# EasyEDA Pro project ProPrj_AUCompetition.epro, schematic 主控

## Sheets
1 电源: Assembly Variant: Basic; Board Name: Board1; Create Date: 2026-04-04; Page Name: P1; Project Name: 21届智控大赛; Schematic Name: Schematic1; Update Date: 2026-04-04; BladeWidth: 10; Company: 嘉立创EDA; Drawed: 郑一航; Page Size: A4; RegionStart: 1; Reviewed: 郑一航; ShowBorder: 1; TitleBlock: 1; TitleBlockPosition: 3; Version: V1.0; XRegionCount: 6; YRegionCount: 4
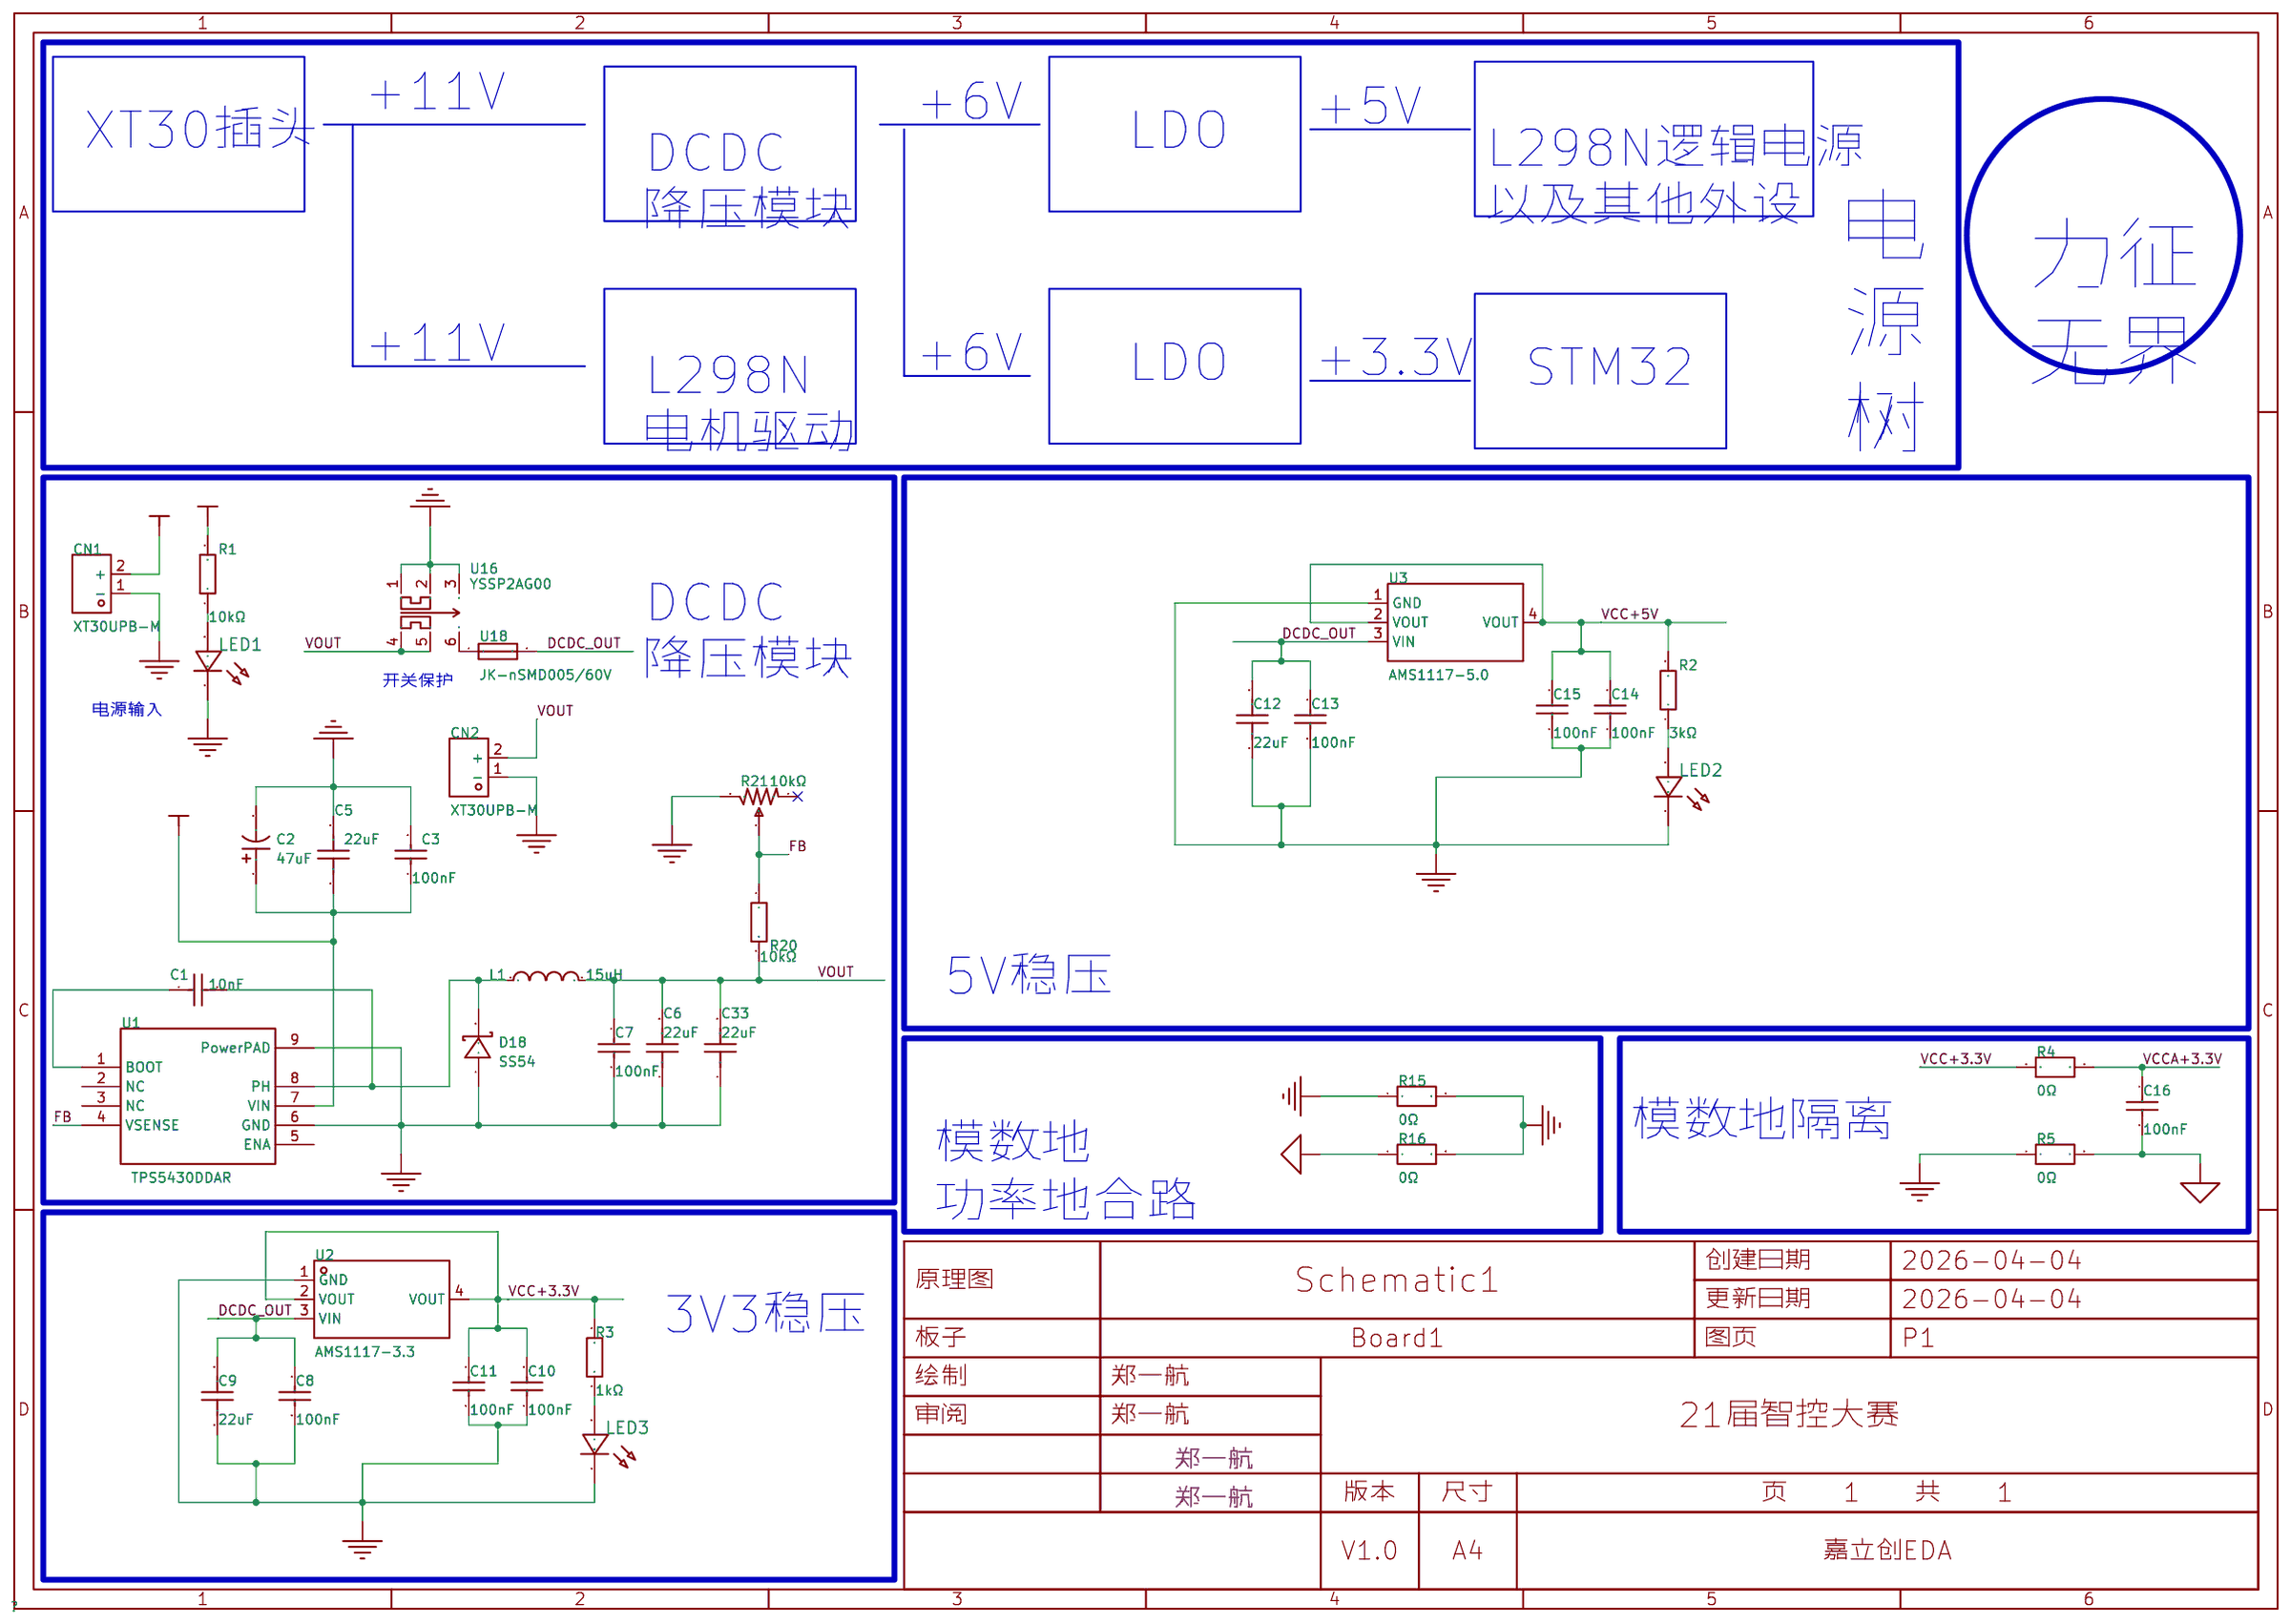
[diagram p2: 电源]
2 单片机: Board Name: 主控; Create Date: 2026-04-05; Schematic Name: 主控; Update Date: 2026-04-05
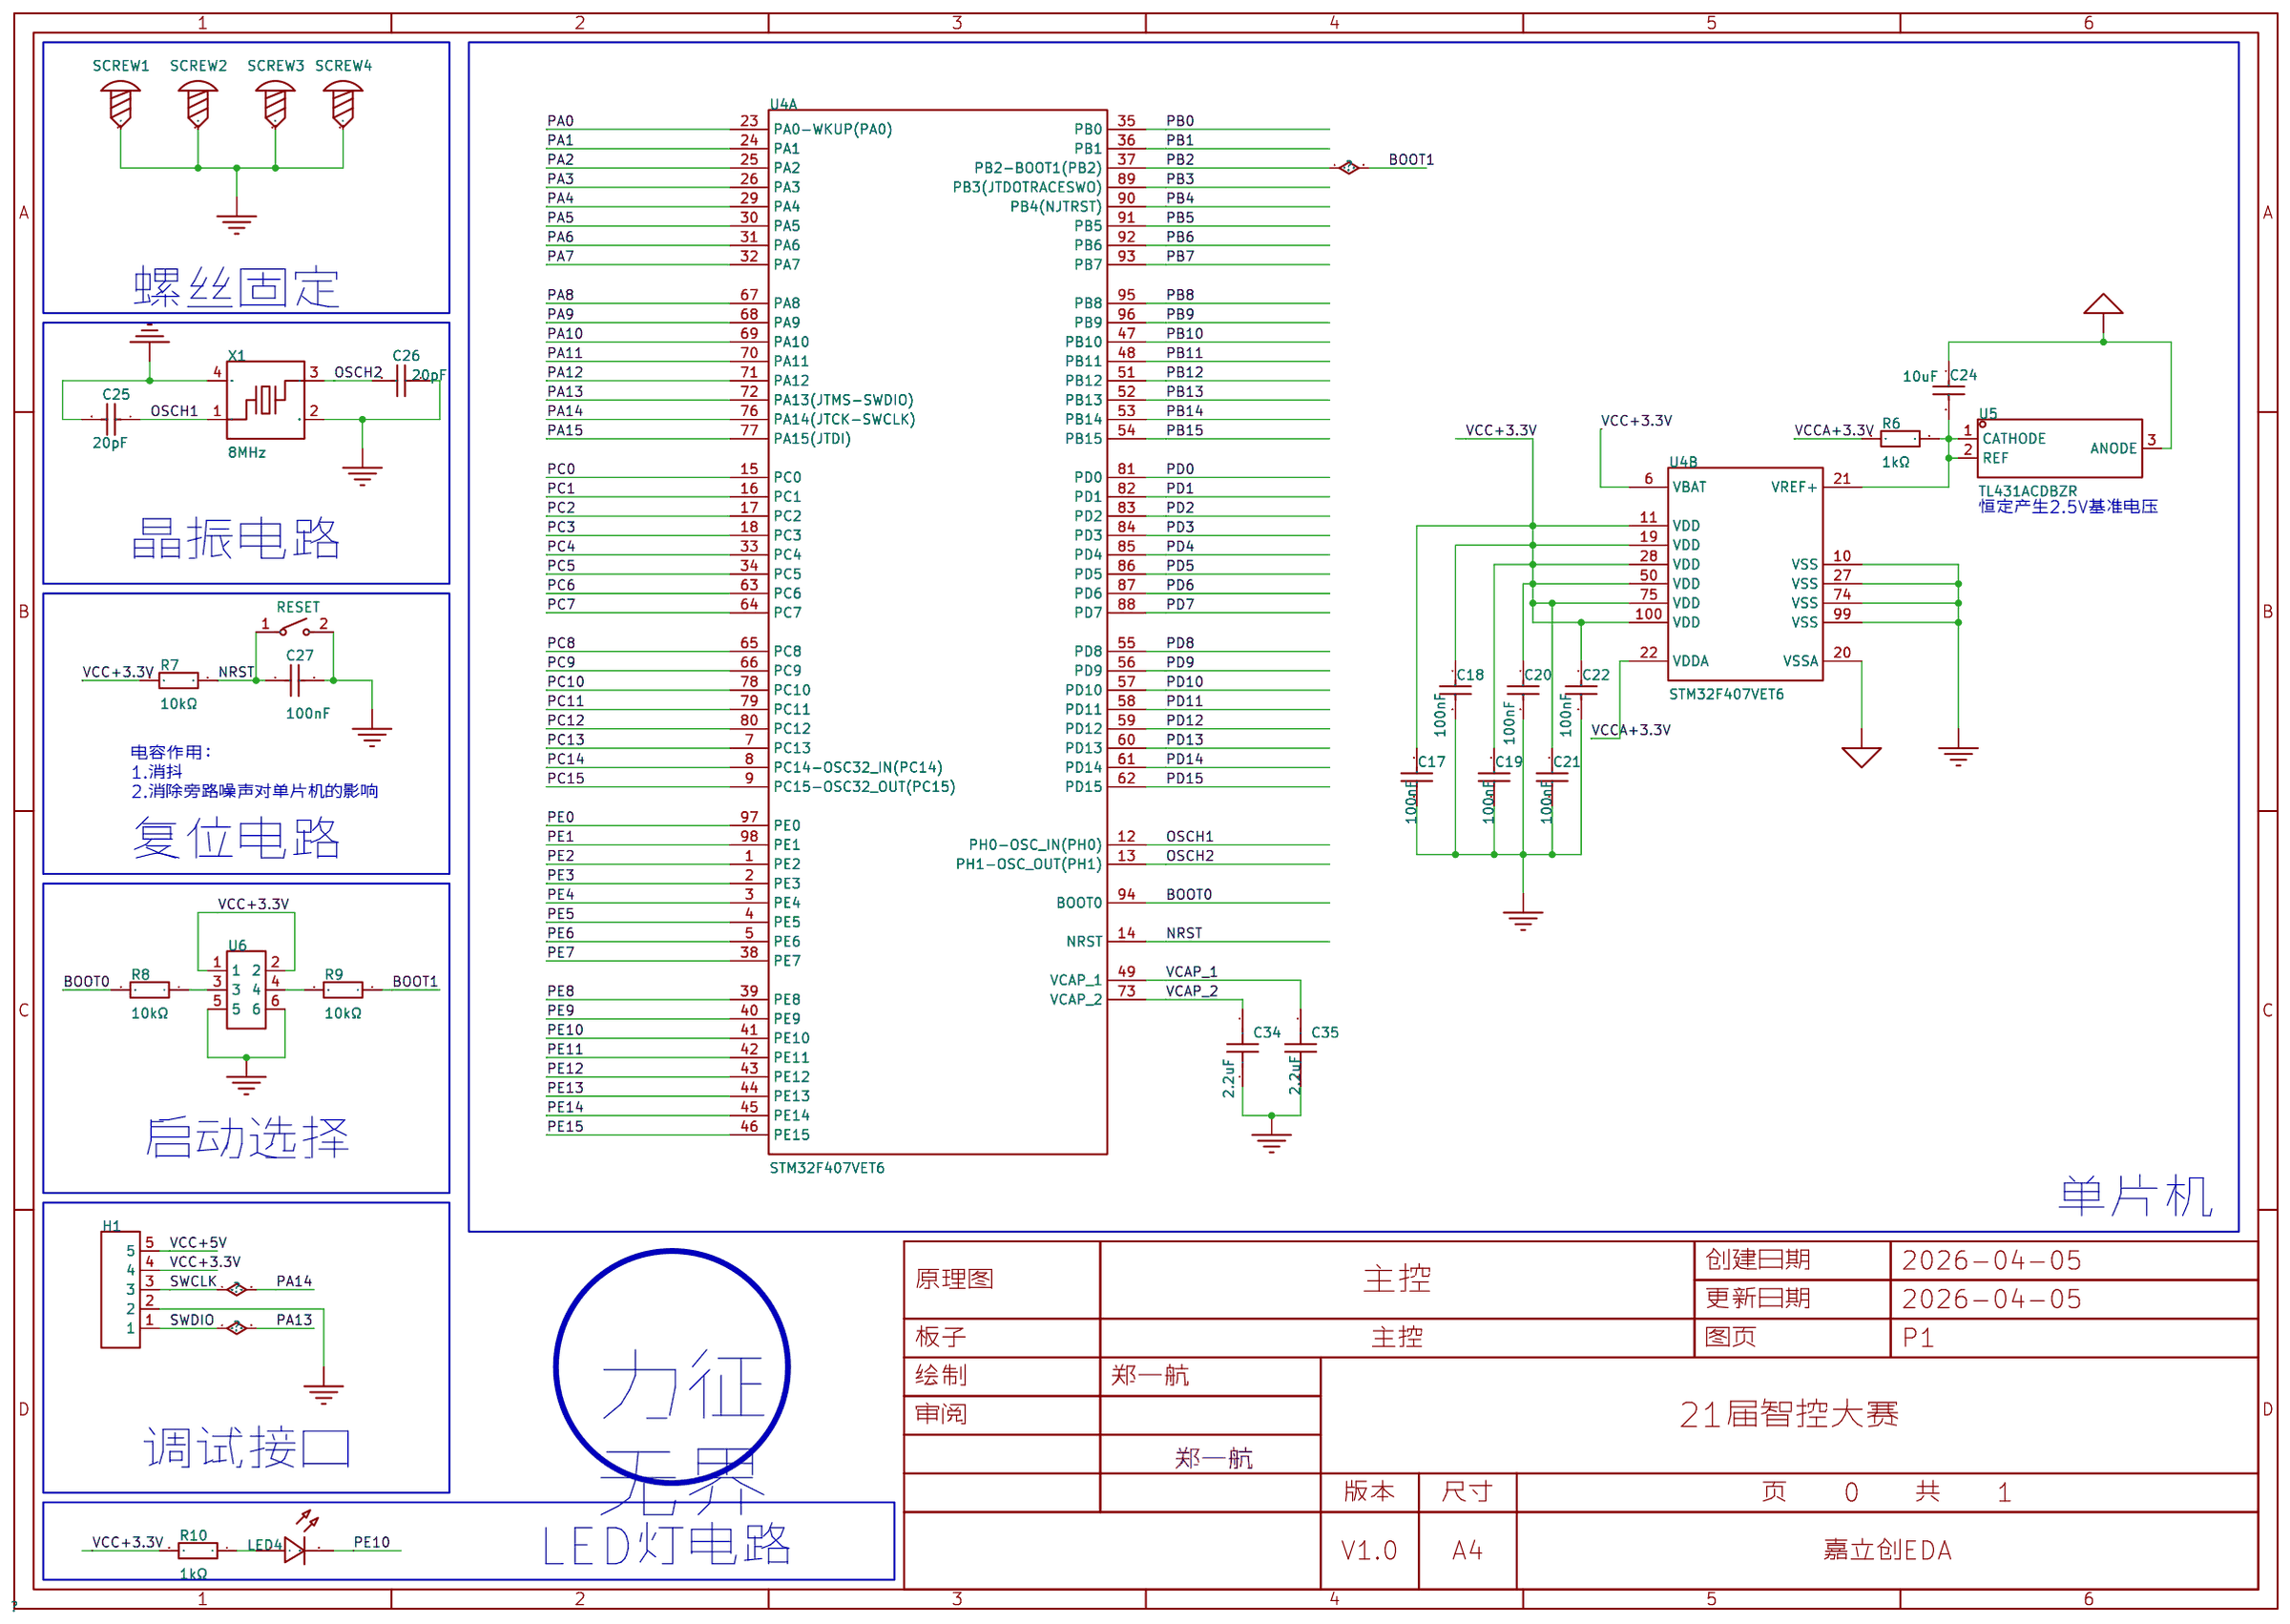
[diagram p3: 单片机]
3 接口: Board Name: 主控; Create Date: 2026-04-05; Schematic Name: 主控; Update Date: 2026-04-05
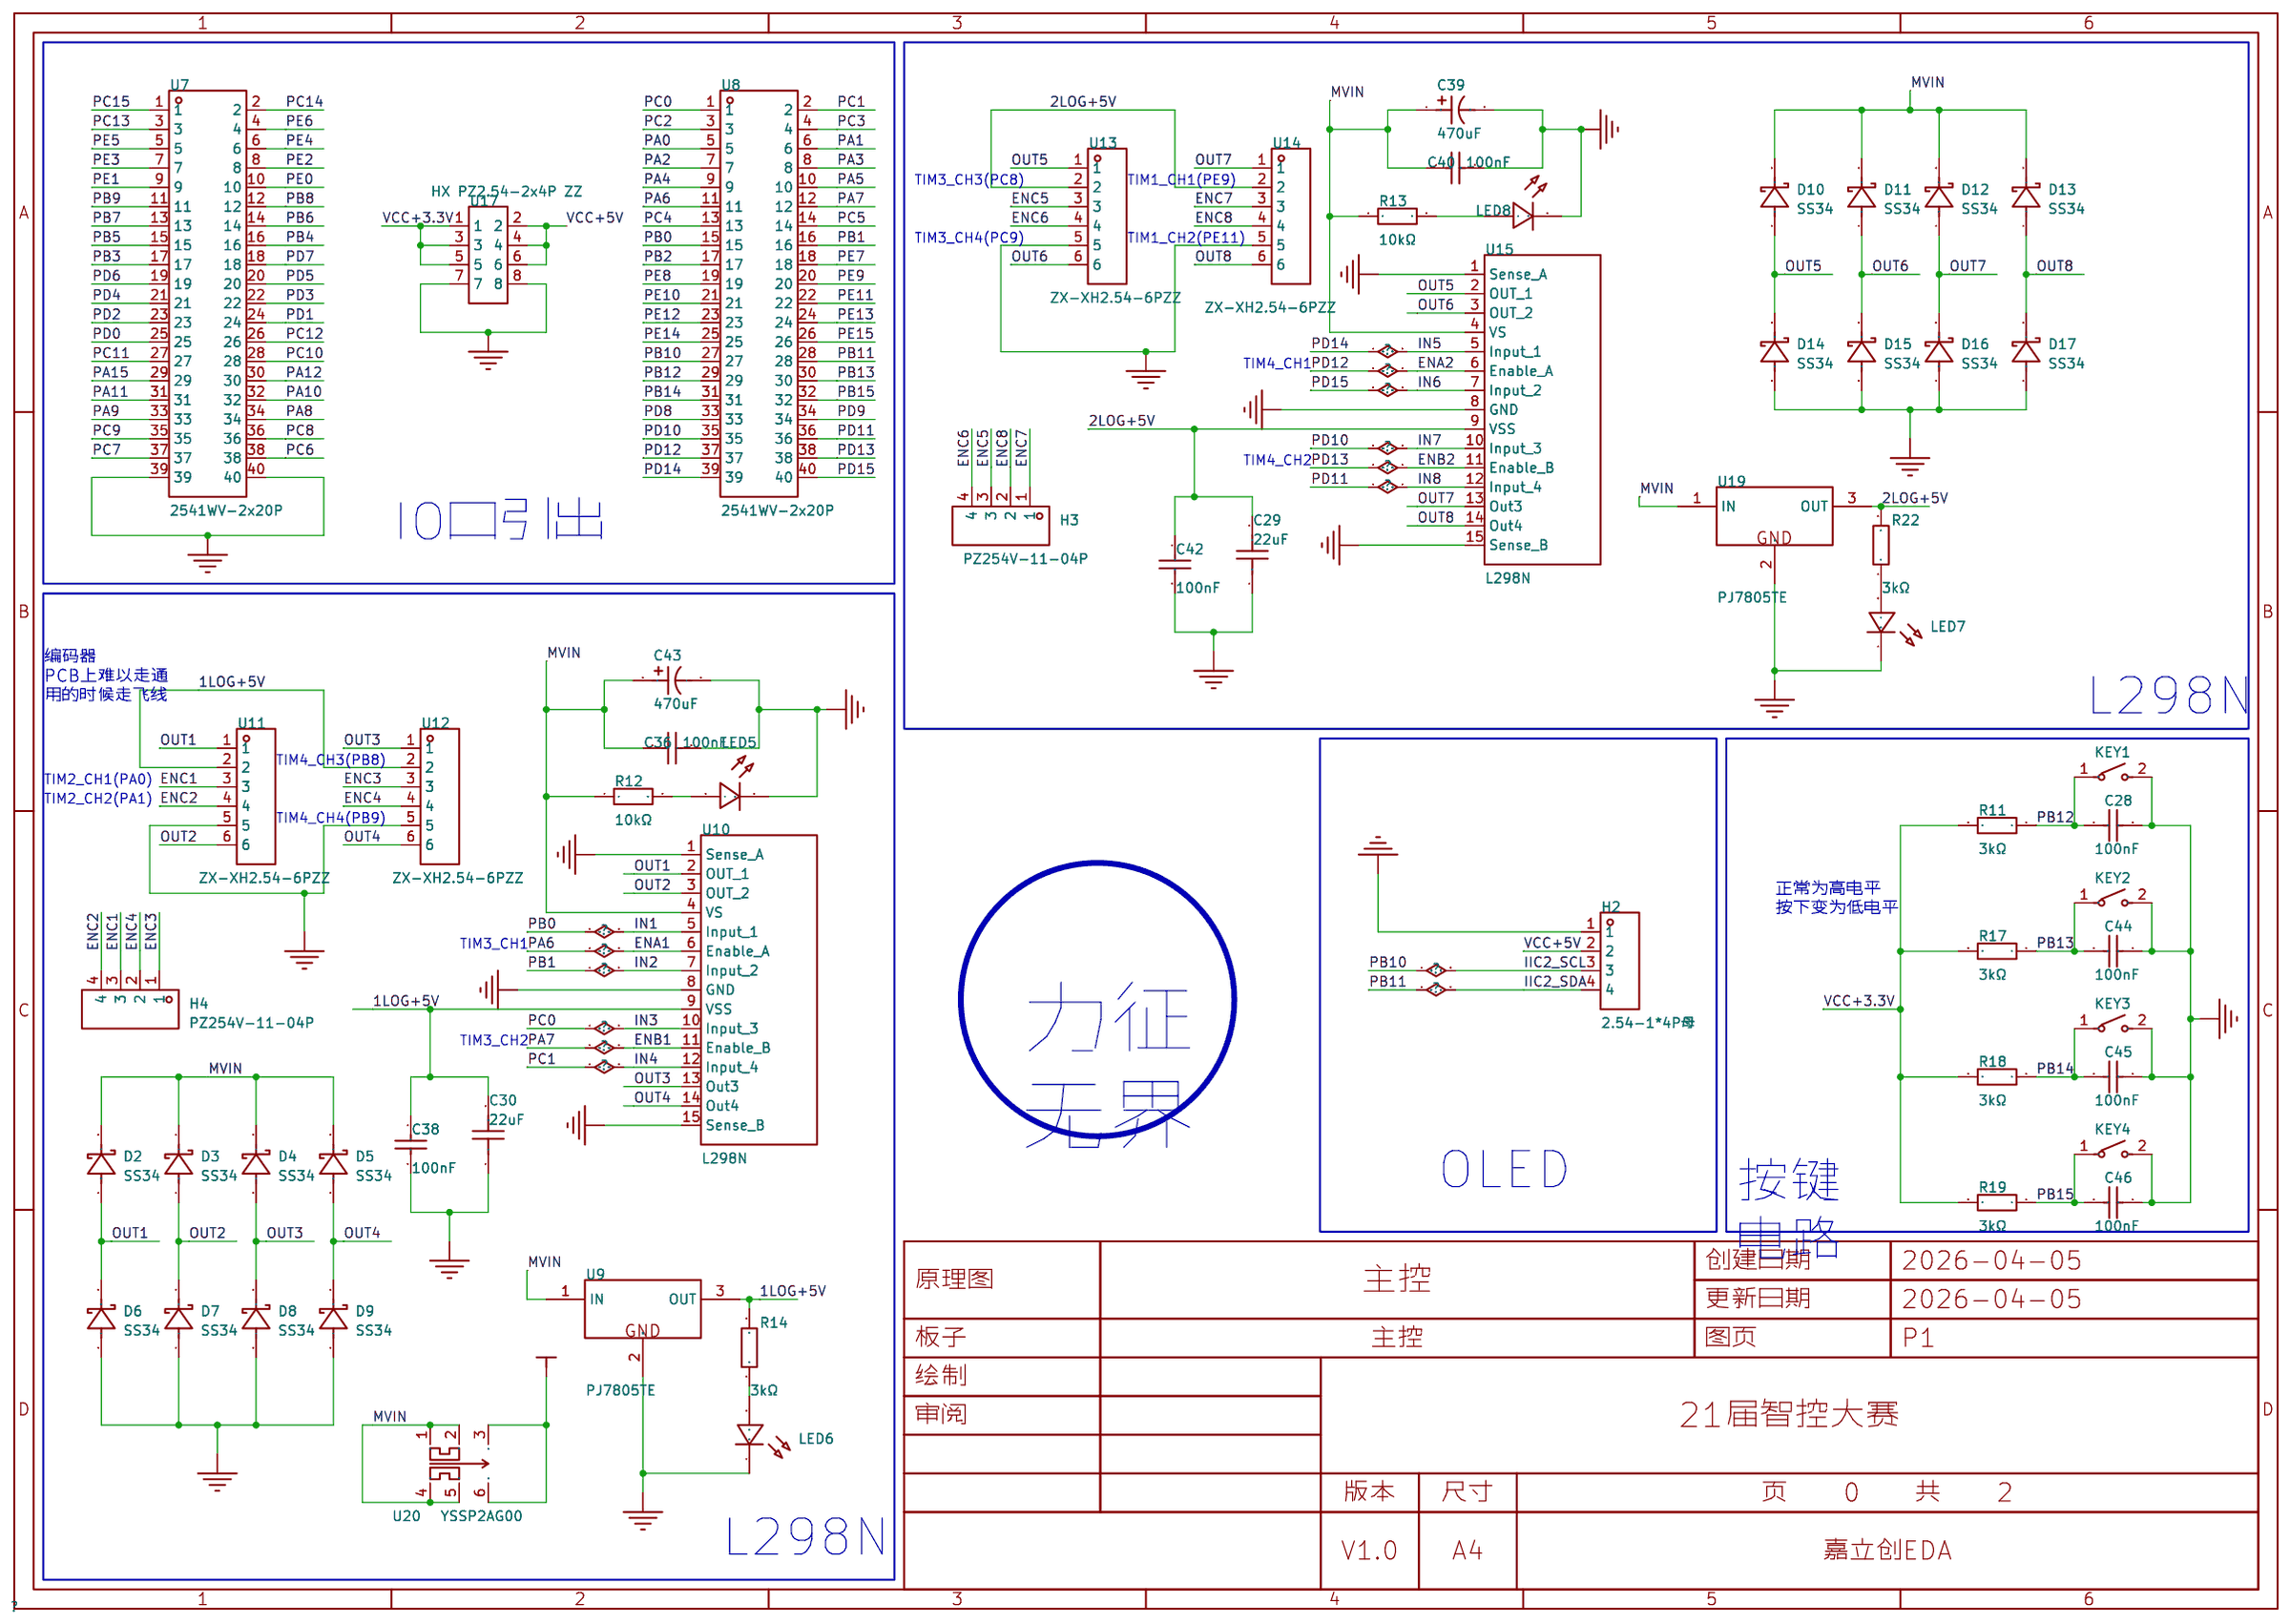
[diagram p4: 接口]

## Parts
sheet 单片机
C17  100nF  [C0805]
C18  100nF  [C0805]
C19  100nF  [C0805]
C20  100nF  [C0805]
C21  100nF  [C0805]
C22  100nF  [C0805]
C24  10uF  [C0805]
C25  20pF  [C0805]
C26  20pF  [C0805]
C27  100nF  [C0805]
C34  2.2uF  [C0805]
C35  2.2uF  [C0805]
H1  PZ254V-11-05P  [HDR-TH_5P-P2.54-V-M]
LED4  -  [LED_0805]
R6  1kΩ  [R0805]
R7  10kΩ  [R0805]
R8  10kΩ  [R0805]
R9  10kΩ  [R0805]
R10  1kΩ  [R0805]
RESET  TS-1088R-02026  [SW-SMD_L3.9-W3.0-P4.45]
SCREW1  -  [M3螺丝]
SCREW2  -  [M3螺丝]
SCREW3  -  [M3螺丝]
SCREW4  -  [M3螺丝]
U4  STM32F407VET6  [LQFP-100_L14.0-W14.0-P0.50-LS16.0-BL]  (sections 1,2)
U5  TL431ACDBZR  [SOT-23-3_L3.0-W1.7-P0.95-LS2.9-BR]
U6  DS1021-2x3SF11-B  [HDR-TH_6P-P2.54-V-M-R2-C3-S2.54]
X1  8MHz  [CRYSTAL-SMD_4P-L3.2-W2.5-BL_SIT8008BI]
sheet 接口
C28  100nF  [C0805]
C29  22uF  [C1210]
C30  22uF  [C1210]
C36  100nF  [C0805]
C38  100nF  [C0805]
C39  470uF  [CAP-TH_BD10.0-P5.00-D0.6-FD-A]
C40  100nF  [C0805]
C42  100nF  [C0805]
C43  470uF  [CAP-TH_BD10.0-P5.00-D0.6-FD-A]
C44  100nF  [C0805]
C45  100nF  [C0805]
C46  100nF  [C0805]
D2  SS34  [SMA_L4.3-W2.6-LS5.0-FD]
D3  SS34  [SMA_L4.3-W2.6-LS5.0-FD]
D4  SS34  [SMA_L4.3-W2.6-LS5.0-FD]
D5  SS34  [SMA_L4.3-W2.6-LS5.0-FD]
D6  SS34  [SMA_L4.3-W2.6-LS5.0-FD]
D7  SS34  [SMA_L4.3-W2.6-LS5.0-FD]
D8  SS34  [SMA_L4.3-W2.6-LS5.0-FD]
D9  SS34  [SMA_L4.3-W2.6-LS5.0-FD]
D10  SS34  [SMA_L4.3-W2.6-LS5.0-FD]
D11  SS34  [SMA_L4.3-W2.6-LS5.0-FD]
D12  SS34  [SMA_L4.3-W2.6-LS5.0-FD]
D13  SS34  [SMA_L4.3-W2.6-LS5.0-FD]
D14  SS34  [SMA_L4.3-W2.6-LS5.0-FD]
D15  SS34  [SMA_L4.3-W2.6-LS5.0-FD]
D16  SS34  [SMA_L4.3-W2.6-LS5.0-FD]
D17  SS34  [SMA_L4.3-W2.6-LS5.0-FD]
H2  2.54-1*4P母  [HDR-TH_4P-P2.54-V-F]
H3  PZ254V-11-04P  [HDR-TH_4P-P2.54-V-M]
H4  PZ254V-11-04P  [HDR-TH_4P-P2.54-V-M]
KEY1  TS-1088R-02026  [SW-SMD_L3.9-W3.0-P4.45]
KEY2  TS-1088R-02026  [SW-SMD_L3.9-W3.0-P4.45]
KEY3  TS-1088R-02026  [SW-SMD_L3.9-W3.0-P4.45]
KEY4  TS-1088R-02026  [SW-SMD_L3.9-W3.0-P4.45]
LED5  -  [LED_0805]
LED6  -  [LED_0805]
LED7  -  [LED_0805]
LED8  -  [LED_0805]
R11  3kΩ  [R0805]
R12  10kΩ  [R0805]
R13  10kΩ  [R0805]
R14  3kΩ  [R0805]
R17  3kΩ  [R0805]
R18  3kΩ  [R0805]
R19  3kΩ  [R0805]
R22  3kΩ  [R0805]
U7  2541WV-2x20P  [HDR-TH_40P-P2.54-V-M-R2-C20-S2.54]
U8  2541WV-2x20P  [HDR-TH_40P-P2.54-V-M-R2-C20-S2.54]
U9  PJ7805TE  [TO-252-2_L6.6-W6.1-P4.57-LS9.9-BR-CW]
U10  L298N  [MULTIWATT-15_L19.6-W5.0-P1.27-L]
U11  ZX-XH2.54-6PZZ  [CONN-TH_6P-P2.50_ZX-XH2.54-6PZZ]
U12  ZX-XH2.54-6PZZ  [CONN-TH_6P-P2.50_ZX-XH2.54-6PZZ]
U13  ZX-XH2.54-6PZZ  [CONN-TH_6P-P2.50_ZX-XH2.54-6PZZ]
U14  ZX-XH2.54-6PZZ  [CONN-TH_6P-P2.50_ZX-XH2.54-6PZZ]
U15  L298N  [MULTIWATT-15_L19.6-W5.0-P1.27-L]
U17  HX PZ2.54-2x4P ZZ  [HDR-TH_8P-P2.54-V-M-R2-C4-S2.54]
U19  PJ7805TE  [TO-252-2_L6.6-W6.1-P4.57-LS9.9-BR-CW]
U20  YSSP2AG00  [SW-SMD_YSSP2AG00]
sheet 电源
C1  10nF  [C0805]
C2  47uF  [CAP-TH_BD8.0-P3.50-D0.6-FD]
C3  100nF  [C0805]
C5  22uF  [C1210]
C6  22uF  [C1210]
C7  100nF  [C0805]
C8  100nF  [C0805]
C9  22uF  [C1210]
C10  100nF  [C0805]
C11  100nF  [C0805]
C12  22uF  [C1210]
C13  100nF  [C0805]
C14  100nF  [C0805]
C15  100nF  [C0805]
C16  100nF  [C0805]
C33  22uF  [C1210]
CN1  XT30UPB-M  [CONN-TH_XT30UPB-M]
CN2  XT30UPB-M  [CONN-TH_XT30UPB-M]
D18  SS54  [SMA_L4.4-W2.8-LS5.4-R-RD]
L1  15uH  [IND-SMD_L7.0-W6.6_FXL0630]
LED1  -  [LED_0805]
LED2  -  [LED_0805]
LED3  -  [LED_0805]
R1  10kΩ  [R0805]
R2  3kΩ  [R0805]
R3  1kΩ  [R0805]
R4  0Ω  [R1206]
R5  0Ω  [R1206]
R15  0Ω  [R1206]
R16  0Ω  [R1206]
R20  10kΩ  [R0805]
R21  10kΩ  [RES-ADJ-TH_3362P]
U1  TPS5430DDAR  [ESOP-8_L4.9-W3.9-P1.27-LS6.0-TL-EP]
U2  AMS1117-3.3  [SOT-223-3_L6.5-W3.4-P2.30-LS7.0-BR]
U3  AMS1117-5.0  [SOT-223_L6.5-W3.5-P2.30-LS7.0-BR]
U16  YSSP2AG00  [SW-SMD_YSSP2AG00]
U18  JK-nSMD005/60V  [F1206]

## Library data of the parts
C3 C7 C8 C10 C11 C13-C22 C24 C27 C28 C36 C38 C40 C42 C44-C46 = CL21B104KBCNNNC: 容值:100nF;精度:±10%;额定电压:50V;温度系数:X7R;; LCSC Part Name: 100nF ±10% 50V; Supplier Part: C1711; Manufacturer: SAMSUNG(三星); Supplier Footprint: 0805; JLCPCB Part Class: 扩展库; Datasheet: https://item.szlcsc.com/datasheet/CL21B104KBCNNNC/2063.html; Supplier: LCSC; Tolerance: ±10%; Voltage Rating: 50V; Temperature Coefficient: X7R
C25 C26 = CL21C200JBANNNC: 容值:20pF;精度:±5%;额定电压:50V;温度系数:C0G;; LCSC Part Name: 20pF ±5% 50V; Supplier Part: C1798; Manufacturer: SAMSUNG(三星); Supplier Footprint: 0805; JLCPCB Part Class: Basic Part; Datasheet: https://item.szlcsc.com/datasheet/CL21C200JBANNNC/2150.html; Supplier: LCSC; Tolerance: ±5%; Voltage Rating: 50V; Temperature Coefficient: C0G
C34 C35 = CL21A225KBQNNNE: 容值:2.2uF;精度:±10%;额定电压:50V;温度系数:X5R;; LCSC Part Name: 2.2uF ±10% 50V; Supplier Part: C377773; Manufacturer: SAMSUNG(三星); Supplier Footprint: 0805; JLCPCB Part Class: Basic Part; Datasheet: https://item.szlcsc.com/datasheet/CL21A225KBQNNNE/350246.html; Supplier: LCSC; Tolerance: ±10%; Voltage Rating: 50V; Temperature Coefficient: X5R
H1 = PZ254V-11-05P: 插针结构:1x5P;间距:2.54mm;行距:-;圆针/方针:方针;安装方式:直插;排数:单排;总PIN位数:5P;额定电流:-;额定电压:-;配合针长度:6mm;塑高:2.5mm;端接针长度:3mm;触头材质:黄铜;触头镀层:-;工作温度:-40℃~+105℃;颜色:黑色;; LCSC Part Name: 1x5P 间距:2.54mm 方针 直插; Supplier Part: C492404; Manufacturer: XFCN(兴飞); Supplier Footprint: 插件,P=2.54mm; JLCPCB Part Class: Extended Part; Datasheet: https://item.szlcsc.com/datasheet/PZ254V-11-05P/502960.html; Supplier: LCSC; Pin Structure: 1x5P; Pitch: 2.54mm; Circluar Pins/Square Pins: 方针; Mounting Type: 直插; Number of Rows: 单排; Number of Pins: 5P; Length of Mating Pin: 6mm; Insulation Height: 2.5mm; Length of End Connection Pin: 3mm; Contact Material: 黄铜; Operating Temperature: -40℃~+105℃; Color: 黑色
LED4 = LED_0805-G: Supplier Footprint: 0805
R1-R3 R6-R14 R17-R20 R22 = 0805W8F1002T5E_C17414: 电阻类型:厚膜电阻;阻值:10kΩ;精度:±1%;功率:125mW;工作电压:150V;温度系数:±100ppm/℃;; LCSC Part Name: 10kΩ ±1% 125mW 厚膜电阻; Supplier Part: C17414; Manufacturer: UNI-ROYAL(厚声); Manufacturer Part: 0805W8F1002T5E; Supplier Footprint: 0805; JLCPCB Part Class: 基础库; Datasheet: https://item.szlcsc.com/datasheet/0805W8F1002T5E/18102.html; Supplier: LCSC; Type: 厚膜电阻; Tolerance: ±1%; Power(Watts): 125mW; Voltage-Supply(Max): 150V; Temperature Coefficient: ±100ppm/℃; Operating Temperature: -55℃~+155℃
KEY1-KEY4 RESET = TS-1088R-02026: 电路结构:单刀单掷;按钮形状:圆形按钮;作用力:2.6N;安装方式:立贴;开关长度:3.9mm;开关宽度:2.93mm;开关高度:2mm;带支架:不带支架;触点电流:50mA;额定电压:12V;带灯:-;工作寿命:10万次;; LCSC Part Name: 3.9*2.93*2mm 立贴 轻触开关; Supplier Part: C455280; Manufacturer: XUNPU(讯普); Supplier Footprint: SMD,4x3mm; JLCPCB Part Class: Extended Part; Datasheet: https://item.szlcsc.com/datasheet/TS-1088R-02026/457635.html; Supplier: LCSC; Circuit: 单刀单掷; Actuator Style: 圆形按钮; Operating Force: 2.6N; Mounting Type: 立贴; Length: 3.9mm; Width: 2.93mm; Switch Height: 2mm; with Bracket: 不带支架; Contact Current: 50mA; Voltage Rating: 12V; Actuator/Cap Color: 黑色; Termination Style: SMD接片; Life: 10万次
SCREW1-SCREW4 = M3螺丝: Supplier Footprint: 插件
U4 = STM32F407VET6: CPU内核:ARM-M4;CPU最大主频:168MHz;应用领域:-;; LCSC Part Name: 带DSP和FPU的高性能基础系列ARM Cortex-M4 MCU，具有512 KB Flash、168 MHz CPU、ART加速器、以太网和FSMC; Supplier Part: C28730; Manufacturer: ST(意法半导体); Supplier Footprint: LQFP-100(14x14); JLCPCB Part Class: Extended Part; Datasheet: https://item.szlcsc.com/datasheet/STM32F407VET6/29482.html; Supplier: LCSC; CPU Core: ARM-M4; CPU Maximum Speed: 168MHz; Program Storage Size: 512KB; Program Memory Type: FLASH; Number of I/O: 82; ADC (Bit): 12bit; DAC (Bit): 12bit; Voltage - Supply: 1.8V~3.6V
U5 = TL431ACDBZR: 输出类型:可调;工作电压:2.495V~36V;输出电压:2.495V~36V;输出电流:100mA;精度:±1%;; Supplier Part: C350683; Manufacturer: TI(德州仪器); Supplier Footprint: SOT-23-3; JLCPCB Part Class: Extended Part; Datasheet: https://www.ti.com/cn/lit/gpn/tl431; Supplier: LCSC; Output Type: 可调; Voltage - Supply: 2.495V~36V; Output Voltage: 2.495V~36V; Output Current: 100mA; Tolerance: ±1%; Reference Type: 并联; Minimum Cathode Current for Regulation: 600uA; Operating Temperature: 0℃~+70℃
U6 = DS1021-2x3SF11-B: 插针结构:2x3P;间距:2.54mm;行距:2.54mm;圆针/方针:方针;安装方式:直插;排数:双排;总PIN位数:6P;额定电流:3A;额定电压:250V;触头材质:铜合金;触头镀层:金;工作温度:-40℃~+105℃;颜色:黑色;; LCSC Part Name: 2x3P 间距:2.54mm 方针 直插; Supplier Part: C7430399; Manufacturer: CONNFLY; Supplier Footprint: 插件,P=2.54mm; JLCPCB Part Class: Extended Part; Datasheet: https://item.szlcsc.com/datasheet/DS1021-2x3SF11-B/8430052.html; Supplier: LCSC; Pin Structure: 2x3P; Pitch: 2.54mm; Row Spacing: 2.54mm; Circluar Pins/Square Pins: 方针; Mounting Type: 直插; Number of Rows: 双排; Number of Pins: 6P; Current Rating: 3A; Voltage Rating (Max): 250V; Contact Material: 铜合金; Contact Plating: 金; Operating Temperature: -40℃~+105℃; Color: 黑色
X1 = XL2EL89CSI-111YLC-8M: 晶振类型:贴片晶振;频率:8MHz;常温频差:±10ppm;负载电容:20pF;频率稳定度:±20ppm;; LCSC Part Name: YSX321SL 8MHZ 4P 3225 20PF ±10PPM -40~85℃ (±20PPM); Supplier Part: C5444548; Manufacturer: YXC(扬兴晶振); Supplier Footprint: SMD3225-4P; JLCPCB Part Class: Extended Part; Datasheet: https://item.szlcsc.com/datasheet/XL2EL89CSI-111YLC-8M/6336544.html; Supplier: LCSC; Type: 贴片晶振; Normal temperature Frequency Tolerance: ±10ppm; Load Capacitance: 20pF; Frequency Stability: ±20ppm; Operating Temperature: -40℃~+85℃
C5 C6 C9 C12 C29 C30 C33 = CL32B226KAJNNNE: 容值:22uF;精度:±10%;额定电压:25V;温度系数:X7R;; LCSC Part Name: 22uF ±10% 25V; Supplier Part: C309062; Manufacturer: SAMSUNG(三星); Supplier Footprint: 1210; JLCPCB Part Class: Extended Part; Datasheet: https://item.szlcsc.com/datasheet/CL32B226KAJNNNE/292813.html; Supplier: LCSC; Tolerance: ±10%; Voltage Rating: 25V; Temperature Coefficient: X7R
C39 C43 = PA50V470M10x17: 容值:470uF;精度:±20%;额定电压:50V;纹波电流:4.1A@100kHz;等效串联电阻(ESR):18mΩ@100kHz;类型:聚合物;; LCSC Part Name: 470uF ±20% 50V; Supplier Part: C46550425; Manufacturer: JIERR(捷而瑞); Supplier Footprint: 插件,D10xL17mm; JLCPCB Part Class: 扩展库; Datasheet: https://item.szlcsc.com/datasheet/PA50V470M10x17/48680119.html; Supplier: LCSC; Tolerance: ±20%; Voltage Rating: 50V; Ripple Current: 4.1A@100kHz; Equivalent Series Resistance(ESR): 18mΩ@100kHz; Type: 聚合物; Diameter: 10mm; Height - Seated (Max): 17mm; Lifetime: 2000hrs@105℃; Operating Temperature: -55℃~+105℃
D2-D17 = SS34_C7420365: 二极管配置:独立式;正向压降(Vf):550mV@3A;直流反向耐压(Vr):40V;整流电流:3A;; LCSC Part Name: 电压:40V 电流:3A; Supplier Part: C7420365; Manufacturer: R+O(宏嘉诚); Supplier Footprint: SMA(DO-214AC); JLCPCB Part Class: Extended Part; Datasheet: https://item.szlcsc.com/datasheet/SS34/8397187.html; Supplier: LCSC; Diode Configuration: 独立式; Voltage - Forward(Vf@If): 550mV@3A; Voltage - DC Reverse(Vr): 40V; Current - Rectified: 3A; Reverse Leakage Current (Ir): 200uA@40V
H2 = 2.54-1*4P母: 插孔结构:1x4P;间距:2.54mm;行距:-;圆孔/方孔:方孔;安装方式:直插;排数:单排;总孔位数:4P;额定电流:3A;额定电压:-;插孔方向:顶部;塑高:-;触头材质:青铜;触头镀层:-;工作温度:-40℃~+105℃;; LCSC Part Name: 间距:2.54mm 1x4P 直插; Supplier Part: C2718488; Manufacturer: BOOMELE(博穆精密); Supplier Footprint: 插件,P=2.54mm; JLCPCB Part Class: Extended Part; Datasheet: https://item.szlcsc.com/datasheet/2.54-1*4P%25E6%25AF%258D/2834502.html; Supplier: LCSC; Holes Structure: 1x4P; Pitch: 2.54mm; Circular Hole / Square Hole: 方孔; Mounting Type: 直插; Number of Rows: 单排; Number of Positions: 4P; Current Rating: 3A; Holes Direction: 顶部; Contact Material: 青铜; Operating Temperature: -40℃~+105℃
H3 H4 = PZ254V-11-04P: 插针结构:1x4P;间距:2.54mm;行距:-;圆针/方针:方针;安装方式:直插;排数:单排;总PIN位数:4P;额定电流:3A;额定电压:250V;配合针长度:6mm;塑高:2.5mm;端接针长度:3mm;触头材质:-;工作温度:-40℃~+105℃;颜色:黑色;; LCSC Part Name: 1x4P 间距:2.54mm 方针 直插; Supplier Part: C2691448; Manufacturer: XFCN(兴飞); Supplier Footprint: 插件,P=2.54mm; JLCPCB Part Class: Extended Part; Datasheet: https://item.szlcsc.com/datasheet/PZ254V-11-04P/2801085.html; Supplier: LCSC; Pin Structure: 1x4P; Pitch: 2.54mm; Circluar Pins/Square Pins: 方针; Mounting Type: 直插; Number of Rows: 单排; Number of Pins: 4P; Current Rating: 3A; Voltage Rating (Max): 250V; Length of Mating Pin: 6mm; Insulation Height: 2.5mm; Length of End Connection Pin: 3mm; Operating Temperature: -40℃~+105℃; Color: 黑色
LED5-LED8 = LED_0805-B: Supplier Footprint: 0805
U7 U8 = 2541WV-2x20P: 插针结构:2x20P;间距:2.54mm;行距:2.54mm;圆针/方针:方针;安装方式:直插;排数:双排;总PIN位数:40P;额定电流:3A;配合针长度:6mm;塑高:2.54mm;端接针长度:3mm;触头材质:黄铜;触头镀层:金;工作温度:-55℃~+105℃;; LCSC Part Name: 2x20P 间距:2.54mm 方针 直插; Supplier Part: C25503140; Manufacturer: HanElectricity(瀚源); Supplier Footprint: 插件,P=2.54mm; JLCPCB Part Class: Extended Part; Datasheet: https://item.szlcsc.com/datasheet/2541WV-2x20P/27233683.html; Supplier: LCSC; Pin Structure: 2x20P; Pitch: 2.54mm; Row Spacing: 2.54mm; Circluar Pins/Square Pins: 方针; Mounting Type: 直插; Number of Rows: 双排; Number of Pins: 40P; Current Rating: 3A; Length of Mating Pin: 6mm; Insulation Height: 2.54mm; Length of End Connection Pin: 3mm; Contact Material: 黄铜; Contact Plating: 金; Operating Temperature: -55℃~+105℃
U9 U19 = PJ7805TE: 输出类型:固定;工作电压:35V;输出电压:5V;输出电流:1.5A;电源纹波抑制比(PSRR):73dB@(120Hz);输出极性:正极;; LCSC Part Name: 输入35V 输出5V 1.5A; Supplier Part: C469396; Manufacturer: PJSEMI(平晶微); Supplier Footprint: TO-252; JLCPCB Part Class: Extended Part; Datasheet: https://item.szlcsc.com/datasheet/PJ7805TE/475744.html; Supplier: LCSC; Output Type: 固定; Voltage - Supply: 35V; Output Voltage: 5V; Output Current: 1.5A; Power Supply Rejection Ratio (PSRR): 73dB@(120Hz); Voltage Dropout: 2V@(1A); standby current: 8mA; Noise: 42uV; Features: 过流保护；短路保护；过热保护; Operating Temperature: -40℃~+125℃@(Tj); Output Configuration: 正极; Number of Outputs: 1
U10 U15 = L298N_C434589: L298是一款采用15引脚Multiwatt和PowerSO20封装的单片集成电路。它是一款高压、大电流双路全桥驱动器，设计用于接收标准TTL逻辑电平，并驱动继电器、螺线管、直流电机和步进电机等感性负载。该器件提供两个使能输入，可独立于输入信号对器件进行使能或禁用操作; Supplier Part: C434589; Manufacturer: HGSEMI(华冠); Supplier Footprint: Multiwatt-15; JLCPCB Part Class: 扩展库; Datasheet: https://item.szlcsc.com/datasheet/L298N/431682.html; Supplier: LCSC; Number of H-bridges: 2; Operating Temperature: -25℃~+130℃
U11-U14 = ZX-XH2.54-6PZZ: 插针结构:1x6P;间距:2.5mm;安装方式:直插;参考系列:XH;总PIN数:6P;排数:1;每排PIN数:6;行距:-;额定电流:3A;触头材质:黄铜;触头镀层:锡;工作温度:-25℃~+85℃;; LCSC Part Name: 1x6P 间距:2.5mm 直插 系列:XH; Supplier Part: C7429636; Manufacturer: Megastar(兆星); Supplier Footprint: 插件,P=2.5mm; JLCPCB Part Class: Extended Part; Datasheet: https://item.szlcsc.com/datasheet/ZX-XH2.54-6PZZ/8427553.html; Supplier: LCSC; Pins Structure: 1x6P; Pitch: 2.5mm; Mounting Type: 直插; Reference Series: XH; Number of Pins: 6P; Number of Rows: 1; Number of PINs Per Row: 6; Current Rating: 3A; Contact Material: 黄铜; Contact Plating: 锡; Operating Temperature: -25℃~+85℃; Voltage Rating: 250V; Plastic Material: PA66; Flame Retardant Rating: UL94V-0; Color: 白色; Z-Height of the Board: 7mm; X-Length of Bottom Edge on Board (Spacing Line): 17.5mm; Y-Width of Bottom Edge on Board: 5.9mm
U17 = HX PZ2.54-2x4P ZZ: 插针结构:2x4P;间距:2.54mm;行距:2.54mm;圆针/方针:方针;安装方式:直插;排数:双排;总PIN位数:8P;额定电流:3A;额定电压:1kV;配合针长度:6mm;塑高:2.5mm;端接针长度:3mm;触头材质:铜合金;触头镀层:金;工作温度:-40℃~+105℃;颜色:黑色;; LCSC Part Name: 2x4P 间距:2.54mm 方针 直插; Supplier Part: C32713277; Manufacturer: hanxia(韩下); Supplier Footprint: 插件,P=2.54mm; JLCPCB Part Class: Extended Part; Datasheet: https://item.szlcsc.com/datasheet/HX%2520PZ2.54-2x4P%2520ZZ/34444557.html; Supplier: LCSC; Pin Structure: 2x4P; Pitch: 2.54mm; Row Spacing: 2.54mm; Circluar Pins/Square Pins: 方针; Mounting Type: 直插; Number of Rows: 双排; Number of Pins: 8P; Current Rating: 3A; Voltage Rating (Max): 1kV; Length of Mating Pin: 6mm; Insulation Height: 2.5mm; Length of End Connection Pin: 3mm; Contact Material: 铜合金; Contact Plating: 金; Operating Temperature: -40℃~+105℃; Color: 黑色
U16 U20 = YSSP2AG00: LCSC Part Name: 9x3.6 正按6脚贴片滑动开关; Supplier Part: C5188558; Manufacturer: YIYUAN(怡远); Supplier Footprint: SMD; JLCPCB Part Class: Extended Part; Datasheet: https://atta.szlcsc.com/upload/public/pdf/source/20221011/AF6FF47B5A85181594B051FD518E9363.pdf; Supplier: LCSC
C1 = 0805B103K500NT_C52278: 容值:10nF;精度:±10%;额定电压:50V;温度系数:X7R;; LCSC Part Name: 10nF ±10% 50V; Supplier Part: C52278; Manufacturer: FH(风华); Manufacturer Part: 0805B103K500NT; Supplier Footprint: 0805; JLCPCB Part Class: 扩展库; Datasheet: https://item.szlcsc.com/datasheet/0805B103K500NT/53292.html; Supplier: LCSC; Tolerance: ±10%; Voltage Rating: 50V; Temperature Coefficient: X7R
C2 = PA100V47M8X11: 容值:47uF;精度:±20%;额定电压:100V;纹波电流:2.9A@100kHz;等效串联电阻(ESR):30mΩ@100kHz;类型:聚合物;; LCSC Part Name: 47uF ±20% 100V; Supplier Part: C49233039; Manufacturer: JIERR(捷而瑞); Supplier Footprint: 插件,D8xL11.5mm; JLCPCB Part Class: Extended Part; Datasheet: https://item.szlcsc.com/datasheet/PA100V47M8X11/51647990.html; Supplier: LCSC; Tolerance: ±20%; Voltage Rating: 100V; Ripple Current: 2.9A@100kHz; Equivalent Series Resistance(ESR): 30mΩ@100kHz; Type: 聚合物; Pin Spacing: 3.5mm; Diameter: 8mm; Height - Seated (Max): 11.5mm; Lifetime: 2000hrs@105℃; Operating Temperature: -55℃~+105℃
CN1 CN2 = XT30UPB-M: Supplier Part: C428721; Manufacturer: AMASS(艾迈斯); JLCPCB Part Class: Extended Part; Datasheet: https://atta.szlcsc.com/upload/public/pdf/source/20190916/C428721_B0ECB8C5937139CEFE8736D2D3175B0E.pdf; Supplier: LCSC
D18 = SS54_C22452: 二极管配置:独立式;正向压降(Vf):550mV@5A;直流反向耐压(Vr):40V;整流电流:5A;; LCSC Part Name: 电压:40V 电流:5A; Supplier Part: C22452; Manufacturer: MDD(辰达半导体); Supplier Footprint: SMA(DO-214AC); JLCPCB Part Class: 基础库; Datasheet: https://item.szlcsc.com/datasheet/SS54/23178.html; Supplier: LCSC; Diode Configuration: 独立式; Voltage - Forward(Vf@If): 550mV@5A; Voltage - DC Reverse(Vr): 40V; Current - Rectified: 5A; Reverse Leakage Current (Ir): 1mA@40V; Operating Junction Temperature Range: -55℃~+125℃
L1 = FXL0630-150-M: 电感值:15uH;精度:±20%;额定电流:3A;饱和电流(Isat):4A;类型:一体成型电感;; LCSC Part Name: 15uH ±20%; Supplier Part: C177243; Manufacturer: cjiang(长江微电); Supplier Footprint: SMD,7x6.6mm; JLCPCB Part Class: Extended Part; Datasheet: https://item.szlcsc.com/datasheet/FXL0630-150-M/188635.html; Supplier: LCSC; Tolerance: ±20%; Current Rating: 3A; Current - Saturation(Isat): 4A; DC Resistance(DCR): 115mΩ; Type: 一体成型电感
LED1-LED3 = LED_0805-R: Supplier Footprint: 0805
R4 R5 R15 R16 = JER1206F1R000: 电阻类型:采样电阻;阻值:0Ω;精度:±1%;功率:1W;温度系数:±50ppm/℃;; LCSC Part Name: 0Ω 1W 1206 ±1%; Supplier Part: C49164949; Manufacturer: JIERR(捷而瑞); Supplier Footprint: 1206; JLCPCB Part Class: 扩展库; Datasheet: https://item.szlcsc.com/datasheet/JER1206F1R000/51553084.html; Supplier: LCSC; Type: 采样电阻; Tolerance: ±1%; Power(Watts): 1W; Temperature Coefficient: ±50ppm/℃
R21 = 3362P-1-103_C48997914: 阻值:10kΩ;精度:±10%;功率:500mW;温度系数:±250ppm/℃;; LCSC Part Name: 3362P-1-103; Supplier Part: C48997914; Manufacturer: JIERR(捷而瑞); Manufacturer Part: 3362P-1-103; Supplier Footprint: 插件-3P,7x6.8mm; JLCPCB Part Class: 扩展库; Datasheet: https://item.szlcsc.com/datasheet/3362P-1-103/51342050.html; Supplier: LCSC; Tolerance: ±10%; Power(Watts): 500mW; Temperature Coefficient: ±250ppm/℃; Number of Turns: 1
U1 = TPS5430DDAR: 功能类型:降压型;工作电压:5.5V~36V;输出电压:1.221V~32.04V;输出电流:3A;输出类型:可调;; LCSC Part Name: 降压型 3A 5.5V~36V; Supplier Part: C9864; Manufacturer: TI(德州仪器); Supplier Footprint: SOIC-8-EP; JLCPCB Part Class: Basic Part; Datasheet: https://www.ti.com/lit/ds/symlink/tps5430.pdf; Supplier: LCSC; Function: 降压型; Voltage - Supply: 5.5V~36V; Output Voltage: 1.221V~32.04V; Output Current: 3A; Frequency - Switching: 500kHz; Operating Temperature: -40℃~+125℃@(TJ); Synchronous Rectifier: 否; Number of Outputs: 1; Topology: 降压式; Quiescent Current: 4.4mA; Switch tube (built-in/external): 内置; Output Type: 可调
U2 = AMS1117-3.3_C6186: 输出类型:固定;输出极性:正;输出通道数:1;最大输入电压:-;输出电压:3.3V;压差:1.3V@(800mA);静态电流(地电流):-;输出电流:1A;电源纹波抑制比(PSRR):72dB@(120Hz);噪声:-;特性:-;工作温度:-;; LCSC Part Name: Vout=3.3V 1A 72dB@(120Hz); Supplier Part: C6186; Manufacturer: 美国AMS; Supplier Footprint: SOT-223; JLCPCB Part Class: Basic Part; Datasheet: https://atta.szlcsc.com/upload/public/pdf/source/20180727/C6186_7A095716F0823C02F1997A905E26C086.pdf; Supplier: LCSC; Output Type: 固定; Output Polarity: 正; Number of Outputs: 1; Output Voltage: 3.3V; Dropout Voltage: 1.3V@(800mA); Output Current: 1A; Power Supply Rejection Ratio (PSRR): 72dB@(120Hz)
U3 = AMS1117-5.0_C6187: 输出类型:固定;工作电压:15V;输出电压:5V;输出电流:1A;电源纹波抑制比(PSRR):60dB;输出极性:正极;; LCSC Part Name: 输入15V 输出5V 1A; Supplier Part: C6187; Manufacturer: AMS; Supplier Footprint: SOT-223; JLCPCB Part Class: Basic Part; Datasheet: https://item.szlcsc.com/datasheet/AMS1117-5.0/6653.html; Supplier: LCSC; Output Type: 固定; Voltage - Supply: 15V; Output Voltage: 5V; Output Current: 1A; Power Supply Rejection Ratio (PSRR): 60dB; Voltage Dropout: 1.3V; Operating Temperature: -40℃~+125℃; Output Configuration: 正极; Number of Outputs: 1
U18 = JK-nSMD005/60V: 耐压(Vmax):60V;最大电流(Imax):100A;保持电流(Ihold):50mA;跳闸电流(Itrip):150mA;; LCSC Part Name: 60V 0.05A 1206自恢复; Supplier Part: C2830235; Manufacturer: JK(金科); Supplier Footprint: 1206; JLCPCB Part Class: Extended Part; Datasheet: https://item.szlcsc.com/datasheet/JK-nSMD005%252F60V/2981864.html; Supplier: LCSC; Voltage - Max: 60V; Current - Max: 100A; Hold Current: 50mA; Trip Current: 150mA; Resistance - Initial (Ri) (Min): 3.6Ω; Resistance - Post Trip (R1) (Max): 50Ω; Time to Trip(Max): 1.5s; Operating Temperature: -40℃~+85℃

## Nets
AGND: C16.2 C24.1 R5.2 R16.1 U4.20(VSSA) U5.3(ANODE)
DGND: C8.2 C9.1 C10.2 C11.2 C12.1 C13.2 C14.2 C15.2 C17.2 C18.2 C19.2 C20.2 C21.2 C22.2 C25.2 C26.1 C27.2 C28.2 C34.1 C35.1 C44.2 C45.2 C46.2 H1.2 H2.1 KEY1.2 KEY2.2 KEY3.2 KEY4.2 LED2.1(C) LED3.1(C) R5.1 R15.1 RESET.2 U2.1(GND) U3.1(GND) U4.10(VSS) U4.27(VSS) U4.74(VSS) U4.99(VSS) U6.5 U6.6 U7.39 U7.40 U11.5 U12.5 U13.5 U14.5 U17.7 U17.8 X1.2(GND) X1.4(GND)
PGND: C2.2 C3.2 C5.2 C6.1 C7.2 C29.1 C30.1 C33.1 C36.2 C38.2 C39.2 C40.2 C42.2 C43.2 CN1.1(-) CN2.1(-) D6.1(A) D7.1(A) D8.1(A) D9.1(A) D14.1(A) D15.1(A) D16.1(A) D17.1(A) D18.1(A) LED1.1(C) LED5.1(C) LED6.1(C) LED7.1(C) LED8.1(C) R15.2 R16.2 R21.3 SCREW1.1 SCREW2.1 SCREW3.1 SCREW4.1 U1.6(GND) U1.9(PowerPAD) U9.2(GND) U10.1(Sense A) U10.8(GND) U10.15(Sense B) U15.1(Sense A) U15.8(GND) U15.15(Sense B) U16.1 U16.2 U16.3 U19.2(GND)
VCC+3.3V: C10.1 C11.1 C17.1 C18.1 C19.1 C20.1 C21.1 C22.1 H1.4 R3.2 R4.1 R7.2 R10.2 R11.2 R17.2 R18.2 R19.2 U2.2(VOUT) U2.4(VOUT) U4.6(VBAT) U4.11(VDD) U4.19(VDD) U4.28(VDD) U4.50(VDD) U4.75(VDD) U4.100(VDD) U6.1 U6.2 U17.1 U17.3 U17.5
VCC+5V: C14.1 C15.1 H1.5 H2.2 R2.2 U3.2(VOUT) U3.4(VOUT) U17.2 U17.4 U17.6
VCCA+3.3V: C16.1 R4.2 R6.2 U4.22(VDDA)
VIN: C2.1 C3.1 C5.1 CN1.2(+) R1.2 U1.7(VIN) U20.3 U20.6
1LOG+5V: C30.2 C38.1 R14.2 U9.3(OUT) U10.9(VSS) U11.2 U12.2
2LOG+5V: C29.2 C42.1 R22.2 U13.2 U14.2 U15.9(VSS) U19.3(OUT)
BOOT0: R8.2 U4.94(BOOT0)
BOOT1: R9.1 U4.37(PB2-BOOT1(PB2)) U8.17
DCDC_OUT: C8.1 C9.2 C12.2 C13.1 U2.3(VIN) U3.3(VIN) U18.2
ENA1: U4.31(PA6) U8.11 U10.6(Enable A)
ENA2: U4.59(PD12) U8.37 U15.6(Enable A)
ENB1: U4.32(PA7) U8.12 U10.11(Enable B)
ENB2: U4.60(PD13) U8.38 U15.11(Enable B)
ENC1: H4.3 U11.3
ENC2: H4.4 U11.4
ENC3: H4.1 U12.3
ENC4: H4.2 U12.4
ENC5: H3.3 U13.3
ENC6: H3.4 U13.4
ENC7: H3.1 U14.3
ENC8: H3.2 U14.4
FB: R20.1 R21.2 U1.4(VSENSE)
IIC2_SCL: H2.3 U4.47(PB10) U8.27
IIC2_SDA: H2.4 U4.48(PB11) U8.28
IN1: U4.35(PB0) U8.15 U10.5(Input 1)
IN2: U4.36(PB1) U8.16 U10.7(Input 2)
IN3: U4.15(PC0) U8.1 U10.10(Input 3)
IN4: U4.16(PC1) U8.2 U10.12(Input 4)
IN5: U4.61(PD14) U8.39 U15.5(Input 1)
IN6: U4.62(PD15) U8.40 U15.7(Input 2)
IN7: U4.57(PD10) U8.35 U15.10(Input 3)
IN8: U4.58(PD11) U8.36 U15.12(Input 4)
MVIN: C36.1 C39.1 C40.1 C43.1 D2.2(K) D3.2(K) D4.2(K) D5.2(K) D10.2(K) D11.2(K) D12.2(K) D13.2(K) R12.1 R13.1 U9.1(IN) U10.4(VS) U15.4(VS) U19.1(IN) U20.1 U20.2 U20.4 U20.5
NRST: C27.1 R7.1 RESET.1 U4.14(NRST)
OSCH1: C25.1 U4.12(PH0-OSC_IN(PH0)) X1.1
OSCH2: C26.2 U4.13(PH1-OSC_OUT(PH1)) X1.3
OUT1: D2.1(A) D6.2(K) U10.2(OUT 1) U11.1
OUT2: D3.1(A) D7.2(K) U10.3(OUT 2) U11.6
OUT3: D4.1(A) D8.2(K) U10.13(Out3) U12.1
OUT4: D5.1(A) D9.2(K) U10.14(Out4) U12.6
OUT5: D10.1(A) D14.2(K) U13.1 U15.2(OUT 1)
OUT6: D11.1(A) D15.2(K) U13.6 U15.3(OUT 2)
OUT7: D12.1(A) D16.2(K) U14.1 U15.13(Out3)
OUT8: D13.1(A) D17.2(K) U14.6 U15.14(Out4)
PA0: U4.23(PA0-WKUP(PA0)) U8.5
PA1: U4.24(PA1) U8.6
PA2: U4.25(PA2) U8.7
PA3: U4.26(PA3) U8.8
PA4: U4.29(PA4) U8.9
PA5: U4.30(PA5) U8.10
PA8: U4.67(PA8) U7.34
PA9: U4.68(PA9) U7.33
PA10: U4.69(PA10) U7.32
PA11: U4.70(PA11) U7.31
PA12: U4.71(PA12) U7.30
PA13: H1.1 U4.72(PA13(JTMS-SWDIO))
PA14: H1.3 U4.76(PA14(JTCK-SWCLK))
PA15: U4.77(PA15(JTDI)) U7.29
PB3: U4.89(PB3(JTDOTRACESWO)) U7.17
PB4: U4.90(PB4(NJTRST)) U7.16
PB5: U4.91(PB5) U7.15
PB6: U4.92(PB6) U7.14
PB7: U4.93(PB7) U7.13
PB8: U4.95(PB8) U7.12
PB9: U4.96(PB9) U7.11
PB12: C28.1 KEY1.1 R11.1 U4.51(PB12) U8.29
PB13: C44.1 KEY2.1 R17.1 U4.52(PB13) U8.30
PB14: C45.1 KEY3.1 R18.1 U4.53(PB14) U8.31
PB15: C46.1 KEY4.1 R19.1 U4.54(PB15) U8.32
PC2: U4.17(PC2) U8.3
PC3: U4.18(PC3) U8.4
PC4: U4.33(PC4) U8.13
PC5: U4.34(PC5) U8.14
PC6: U4.63(PC6) U7.38
PC7: U4.64(PC7) U7.37
PC8: U4.65(PC8) U7.36
PC9: U4.66(PC9) U7.35
PC10: U4.78(PC10) U7.28
PC11: U4.79(PC11) U7.27
PC12: U4.80(PC12) U7.26
PC13: U4.7(PC13) U7.3
PC14: U4.8(PC14-OSC32_IN(PC14)) U7.2
PC15: U4.9(PC15-OSC32_OUT(PC15)) U7.1
PD0: U4.81(PD0) U7.25
PD1: U4.82(PD1) U7.24
PD2: U4.83(PD2) U7.23
PD3: U4.84(PD3) U7.22
PD4: U4.85(PD4) U7.21
PD5: U4.86(PD5) U7.20
PD6: U4.87(PD6) U7.19
PD7: U4.88(PD7) U7.18
PD8: U4.55(PD8) U8.33
PD9: U4.56(PD9) U8.34
PE0: U4.97(PE0) U7.10
PE1: U4.98(PE1) U7.9
PE2: U4.1(PE2) U7.8
PE3: U4.2(PE3) U7.7
PE4: U4.3(PE4) U7.6
PE5: U4.4(PE5) U7.5
PE6: U4.5(PE6) U7.4
PE7: U4.38(PE7) U8.18
PE8: U4.39(PE8) U8.19
PE9: U4.40(PE9) U8.20
PE10: LED4.1(C) U4.41(PE10) U8.21
PE11: U4.42(PE11) U8.22
PE12: U4.43(PE12) U8.23
PE13: U4.44(PE13) U8.24
PE14: U4.45(PE14) U8.25
PE15: U4.46(PE15) U8.26
VCAP_1: C35.2 U4.49(VCAP_1)
VCAP_2: C34.2 U4.73(VCAP_2)
VOUT: C6.2 C7.1 C33.2 CN2.2(+) L1.2 R20.2 U16.4 U16.5
$1N3: LED1.2(A) R1.1
$1N7: C1.1 U1.1(BOOT)
$1N8: C1.2 D18.2(K) L1.1 U1.8(PH)
$1N28: LED2.2(A) R2.1
$1N30: LED3.2(A) R3.1
$1N49: U16.6 U18.1
$2N98: C24.2 R6.1 U4.21(VREF+) U5.1(CATHODE) U5.2(REF)
$2N110: R8.1 U6.3
$2N112: R9.2 U6.4
$2N122: LED4.2(A) R10.1
$3N203: LED8.2(A) R13.2
$3N205: LED6.2(A) R14.1
$3N206: LED7.2(A) R22.1
Net-(LED5-2): LED5.2(A) R12.2

Not connected (* = marked no-connect by the designer): R21 1*; U1 2(NC) 3(NC) 5(ENA)

## Notes on the sheets
sheet 1
- +11V
- DCDC
  降压模块
- +6V
- +5V
- L298N逻辑电源
  以及其他外设
- XT30插头
- LDO
- 电
  源
  树
- 力征
  无界
- +11V
- L298N
  电机驱动
- +6V
- LDO
- +3.3V
- STM32
- DCDC
  降压模块
- 开关保护
- 电源输入
- 5V稳压
- 模数地
  功率地合路
- 模数地隔离
- 3V3稳压
sheet 2
- 螺丝固定
- 恒定产生2.5V基准电压
- 晶振电路
- 电容作用：
  1.消抖
  2.消除旁路噪声对单片机的影响
- 复位电路
- 启动选择
- 单片机
- 力征
  无界
- 调试接口
- LED灯电路
sheet 3
- TIM3_CH3(PC8)
- TIM1_CH1(PE9)
- TIM3_CH4(PC9)
- TIM1_CH2(PE11)
- TIM4_CH1
- TIM4_CH2
- IO口引出
- 编码器
  PCB上难以走通
  用的时候走飞线
- L298N
- TIM4_CH3(PB8)
- TIM2_CH1(PA0)
- TIM2_CH2(PA1)
- TIM4_CH4(PB9)
- 正常为高电平
  按下变为低电平
- TIM3_CH1
- 力征
  无界
- TIM3_CH2
- 按键
  电路
- OLED
- L298N
